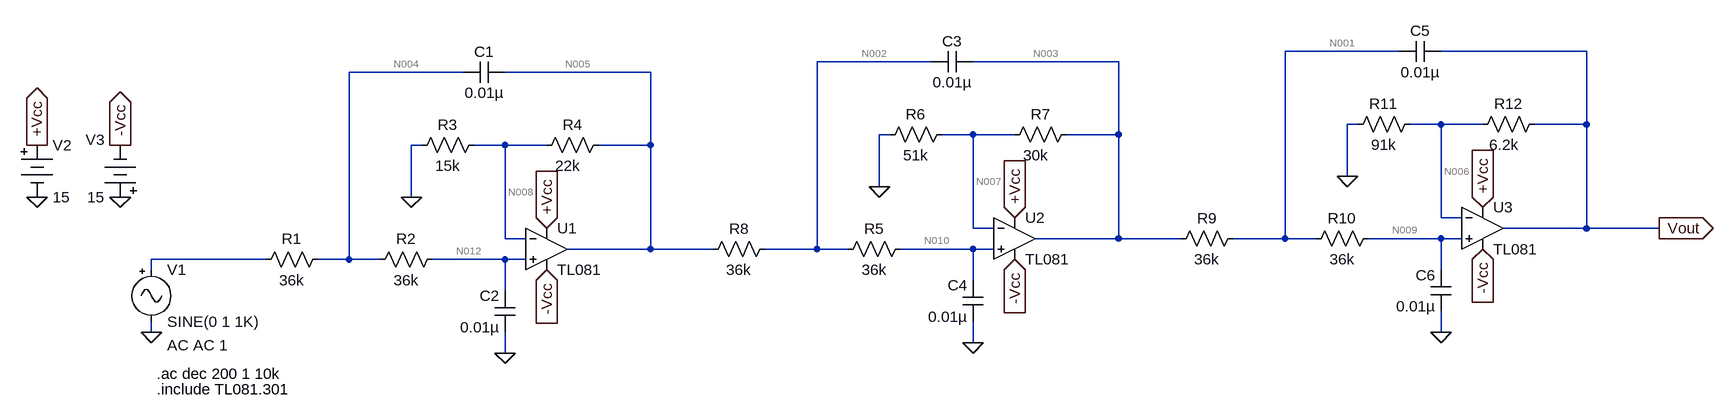
[diagram p0: schematic 6th order Butterworth filter.asc]
6th order Butterworth filter.asc, the LTspice schematic file:
Version 4
SHEET 1 2320 680
WIRE 1808 -160 1632 -160
WIRE 2096 -160 1872 -160
WIRE 1088 -144 912 -144
WIRE 1376 -144 1152 -144
WIRE 368 -128 192 -128
WIRE 656 -128 432 -128
WIRE 1744 -48 1728 -48
WIRE 1872 -48 1824 -48
WIRE 1936 -48 1872 -48
WIRE 2096 -48 2096 -160
WIRE 2096 -48 2016 -48
WIRE 1024 -32 1008 -32
WIRE 1152 -32 1104 -32
WIRE 1216 -32 1152 -32
WIRE 1376 -32 1376 -144
WIRE 1376 -32 1296 -32
WIRE 304 -16 288 -16
WIRE 432 -16 384 -16
WIRE 496 -16 432 -16
WIRE 656 -16 656 -128
WIRE 656 -16 576 -16
WIRE 1728 32 1728 -48
WIRE 1008 48 1008 -32
WIRE 288 64 288 -16
WIRE 1872 96 1872 -48
WIRE 1904 96 1872 96
WIRE 1152 112 1152 -32
WIRE 1184 112 1152 112
WIRE 2096 112 2096 -48
WIRE 2096 112 1968 112
WIRE 2208 112 2096 112
WIRE 432 128 432 -16
WIRE 464 128 432 128
WIRE 1376 128 1376 -32
WIRE 1376 128 1248 128
WIRE 1472 128 1376 128
WIRE 1632 128 1632 -160
WIRE 1632 128 1552 128
WIRE 1680 128 1632 128
WIRE 1872 128 1760 128
WIRE 1904 128 1872 128
WIRE 656 144 656 -16
WIRE 656 144 528 144
WIRE 752 144 656 144
WIRE 912 144 912 -144
WIRE 912 144 832 144
WIRE 960 144 912 144
WIRE 1152 144 1040 144
WIRE 1184 144 1152 144
WIRE 64 160 -112 160
WIRE 192 160 192 -128
WIRE 192 160 144 160
WIRE 240 160 192 160
WIRE 432 160 320 160
WIRE 464 160 432 160
WIRE -112 176 -112 160
WIRE 1872 176 1872 128
WIRE 1152 192 1152 144
WIRE 432 208 432 160
WIRE -112 272 -112 256
WIRE 1872 272 1872 240
WIRE 1152 288 1152 256
WIRE 432 304 432 272
FLAG 432 304 0
FLAG 288 64 0
FLAG -112 272 0
FLAG -288 64 0
FLAG -160 64 0
FLAG -288 -16 +Vcc
IOPIN -288 -16 Out
FLAG -160 -16 -Vcc
IOPIN -160 -16 Out
FLAG 496 112 +Vcc
IOPIN 496 112 In
FLAG 496 176 -Vcc
IOPIN 496 176 In
FLAG 1152 288 0
FLAG 1008 48 0
FLAG 1216 96 +Vcc
IOPIN 1216 96 In
FLAG 1216 160 -Vcc
IOPIN 1216 160 In
FLAG 1872 272 0
FLAG 1728 32 0
FLAG 1936 80 +Vcc
IOPIN 1936 80 In
FLAG 1936 144 -Vcc
IOPIN 1936 144 In
FLAG 2208 112 Vout
IOPIN 2208 112 Out
SYMBOL res 160 144 R90
WINDOW 0 0 56 VBottom 2
WINDOW 3 32 56 VTop 2
SYMATTR InstName R1
SYMATTR Value 36k
SYMBOL res 336 144 R90
WINDOW 0 0 56 VBottom 2
WINDOW 3 32 56 VTop 2
SYMATTR InstName R2
SYMATTR Value 36k
SYMBOL res 400 -32 R90
WINDOW 0 0 56 VBottom 2
WINDOW 3 32 56 VTop 2
SYMATTR InstName R3
SYMATTR Value 15k
SYMBOL res 592 -32 R90
WINDOW 0 0 56 VBottom 2
WINDOW 3 32 63 VTop 2
SYMATTR InstName R4
SYMATTR Value 22k
SYMBOL cap 432 -144 R90
WINDOW 0 0 32 VBottom 2
WINDOW 3 32 32 VTop 2
SYMATTR InstName C1
SYMATTR Value 0.01µ
SYMBOL cap 448 272 R180
WINDOW 0 24 56 Left 2
WINDOW 3 24 8 Left 2
SYMATTR InstName C2
SYMATTR Value 0.01µ
SYMBOL Misc\\signal -112 160 R0
WINDOW 123 24 132 Left 2
WINDOW 39 0 0 Left 0
SYMATTR Value2 AC AC 1
SYMATTR InstName V1
SYMBOL Misc\\battery -288 -32 R0
WINDOW 123 0 0 Left 0
WINDOW 39 0 0 Left 0
SYMATTR InstName V2
SYMATTR Value 15
SYMBOL Misc\\battery -160 80 R180
WINDOW 0 24 104 Left 2
WINDOW 3 24 16 Left 2
WINDOW 123 0 0 Left 0
WINDOW 39 0 0 Left 0
SYMATTR InstName V3
SYMATTR Value 15
SYMBOL res 1056 128 R90
WINDOW 0 0 56 VBottom 2
WINDOW 3 32 56 VTop 2
SYMATTR InstName R5
SYMATTR Value 36k
SYMBOL res 1120 -48 R90
WINDOW 0 0 56 VBottom 2
WINDOW 3 32 56 VTop 2
SYMATTR InstName R6
SYMATTR Value 51k
SYMBOL res 1312 -48 R90
WINDOW 0 0 56 VBottom 2
WINDOW 3 32 63 VTop 2
SYMATTR InstName R7
SYMATTR Value 30k
SYMBOL cap 1152 -160 R90
WINDOW 0 0 32 VBottom 2
WINDOW 3 32 32 VTop 2
SYMATTR InstName C3
SYMATTR Value 0.01µ
SYMBOL cap 1168 256 R180
WINDOW 0 24 56 Left 2
WINDOW 3 24 8 Left 2
SYMATTR InstName C4
SYMATTR Value 0.01µ
SYMBOL res 848 128 R90
WINDOW 0 0 56 VBottom 2
WINDOW 3 32 56 VTop 2
SYMATTR InstName R8
SYMATTR Value 36k
SYMBOL res 1568 112 R90
WINDOW 0 0 56 VBottom 2
WINDOW 3 32 56 VTop 2
SYMATTR InstName R9
SYMATTR Value 36k
SYMBOL res 1776 112 R90
WINDOW 0 0 56 VBottom 2
WINDOW 3 32 56 VTop 2
SYMATTR InstName R10
SYMATTR Value 36k
SYMBOL res 1840 -64 R90
WINDOW 0 0 56 VBottom 2
WINDOW 3 32 56 VTop 2
SYMATTR InstName R11
SYMATTR Value 91k
SYMBOL res 2032 -64 R90
WINDOW 0 0 56 VBottom 2
WINDOW 3 32 63 VTop 2
SYMATTR InstName R12
SYMATTR Value 6.2k
SYMBOL cap 1872 -176 R90
WINDOW 0 0 32 VBottom 2
WINDOW 3 32 32 VTop 2
SYMATTR InstName C5
SYMATTR Value 0.01µ
SYMBOL cap 1888 240 R180
WINDOW 0 24 56 Left 2
WINDOW 3 24 8 Left 2
SYMATTR InstName C6
SYMATTR Value 0.01µ
SYMBOL OpAmps\\opamp2 496 80 R0
SYMATTR InstName U1
SYMATTR Value TL081
SYMBOL OpAmps\\opamp2 1216 64 R0
SYMATTR InstName U2
SYMATTR Value TL081
SYMBOL OpAmps\\opamp2 1936 48 R0
SYMATTR InstName U3
SYMATTR Value TL081
TEXT -104 336 Left 2 !.ac dec 200 1 10k
TEXT -104 360 Left 2 !.include TL081.301

The netlist it stands for:
* 6th order Butterworth filter.asc
R1 N004 N011 36k
R2 N012 N004 36k
R3 N008 0 15k
R4 N005 N008 22k
C1 N005 N004 0.01µ
C2 0 N012 0.01µ
V1 N011 0 SINE(0 1 1K) AC AC 1
V2 +Vcc 0 15
V3 0 -Vcc 15
R5 N010 N002 36k
R6 N007 0 51k
R7 N003 N007 30k
C3 N003 N002 0.01µ
C4 0 N010 0.01µ
R8 N002 N005 36k
R9 N001 N003 36k
R10 N009 N001 36k
R11 N006 0 91k
R12 Vout N006 6.2k
C5 Vout N001 0.01µ
C6 0 N009 0.01µ
XU1 N012 N008 +Vcc -Vcc N005 TL081  ; pins In+ In- V+ V- OUT
XU2 N010 N007 +Vcc -Vcc N003 TL081  ; pins In+ In- V+ V- OUT
XU3 N009 N006 +Vcc -Vcc Vout TL081  ; pins In+ In- V+ V- OUT
.ac dec 200 1 10k
.include TL081.301
.backanno
.end

* Results of the author's LTspice run, read from the files saved beside the schematic
* Operating Point, zero values left out:
*   V(n004) = -1.622 µV
*   V(n012) = -3.244 µV
*   V(n008) = 7.727 µV
*   V(n005) = 20.05 µV
*   V(+vcc) = 15 V
*   V(-vcc) = -15 V
*   V(n010) = 16.81 µV
*   V(n002) = 18.43 µV
*   V(n007) = 27.78 µV
*   V(n003) = 45.47 µV
*   V(n001) = 43.85 µV
*   V(n009) = 42.22 µV
*   V(n006) = 53.19 µV
*   V(vout) = 57.1 µV
*   I(R1) = -45.05 pA
*   I(R2) = -45.05 pA
*   I(R3) = 515.1 pA
*   I(R4) = 560.2 pA
*   I(R5) = -45.05 pA
*   I(R6) = 544.6 pA
*   I(R7) = 589.7 pA
*   I(R8) = -45.05 pA
*   I(R9) = -45.05 pA
*   I(R10) = -45.05 pA
*   I(R11) = 584.5 pA
*   I(R12) = 629.6 pA
*   I(V1) = -45.05 pA
*   I(V2) = -42.58 mA
*   I(V3) = -42.58 mA
*   Ix(u1:1) = 45.05 pA
*   Ix(u1:2) = 45.05 pA
*   Ix(u1:3) = 14.19 mA
*   Ix(u1:4) = -14.19 mA
*   Ix(u1:5) = -605.2 pA
*   Ix(u2:1) = 45.05 pA
*   Ix(u2:2) = 45.05 pA
*   Ix(u2:3) = 14.19 mA
*   Ix(u2:4) = -14.19 mA
*   Ix(u2:5) = -634.8 pA
*   Ix(u3:1) = 45.05 pA
*   Ix(u3:2) = 45.05 pA
*   Ix(u3:3) = 14.19 mA
*   Ix(u3:4) = -14.19 mA
*   Ix(u3:5) = -629.6 pA
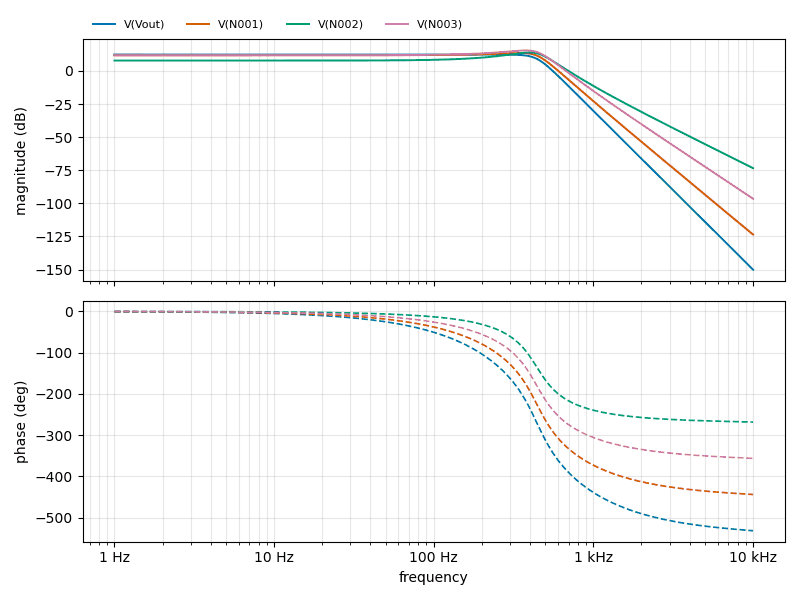
[diagram p1: AC Analysis of 6th order Butterworth filter.asc, plotted from the saved traces]
* AC Analysis, 1 run:
*   V(Vout): 12.43 dB at 1 Hz, -150.12 dB at 10 kHz, peak 12.43 dB at 1 Hz, 3 dB below the peak at 437.8 Hz
*   V(N001): 11.86 dB at 1 Hz, -123.60 dB at 10 kHz, peak 13.59 dB at 346.7 Hz, 3 dB below the peak at 460.9 Hz
*   V(N002): 7.84 dB at 1 Hz, -73.42 dB at 10 kHz, peak 13.99 dB at 393.6 Hz, 3 dB below the peak at 240.4 Hz and 496 Hz
*   V(N003): 11.86 dB at 1 Hz, -96.50 dB at 10 kHz, peak 15.54 dB at 375.8 Hz, 3 dB below the peak at 134.5 Hz and 478.3 Hz